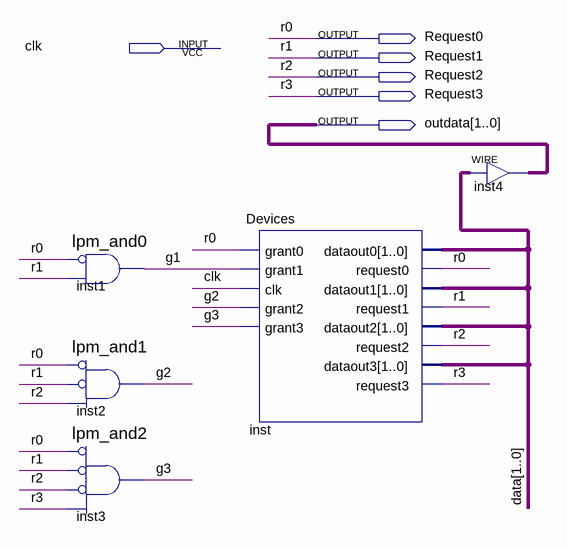
[diagram p0: schematic sheet]
// Quartus schematic Bus.bdf as structural Verilog: 5 symbols, 6 pins
module Bus (
  input  clk,
  output Request0,
  output Request1,
  output Request2,
  output Request3,
  output [1:0] outdata
);

  wire g1, g2, g3;
  wire [1:0] data;

  lpm_and0 inst1 (.data0(~Request0), .data1(Request1), .result(g1));
  lpm_and1 inst2 (.data0(~Request0), .data1(~Request1), .data2(Request2), .result(g2));
  lpm_and2 inst3 (.data0(~Request0), .data1(~Request1), .data2(~Request2), .data3(Request3), .result(g3));
  Devices inst (
    .grant0(Request0), .grant1(g1), .clk(clk), .grant2(g2), .grant3(g3), .dataout0(data),
    .request0(Request0), .dataout1(data), .request1(Request1), .dataout2(data), .request2(Request2),
    .dataout3(data), .request3(Request3));
  assign outdata = data;  // WIRE inst4

  // Other names for the same wires on the sheet: r0 = Request0; r1 = Request1; r2 = Request2; r3 = Request3
endmodule
